# Altium schematic sheet max3107.SchDoc
size A4
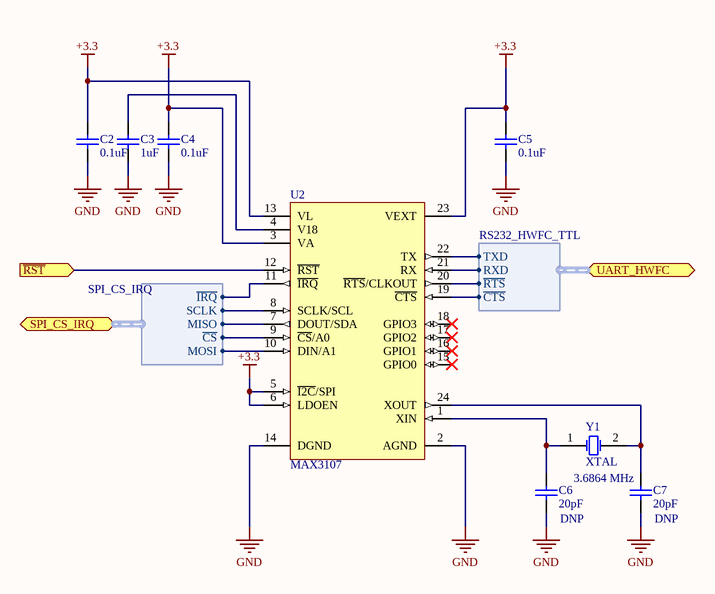
[diagram p0: max3107.SchDoc]

## Parts
C2  value 0.1uF  [C0603]  (hidden comment: Cap)
C3  value 1uF  [C0603]  (hidden comment: Cap)
C4  value 0.1uF  [C0603]  (hidden comment: Cap)
C5  value 0.1uF  [C0603]  (hidden comment: Cap)
C6  value 20pF  Place: DNP  [C0603]  (hidden comment: Cap)
C7  value 20pF  Place: DNP  [C0603]  (hidden comment: Cap)
U2  MAX3107  [MAX3107]
Y1  XTAL  value 3.6864 MHz  [FQ1045A-3.6864]

## Ports
SPI_CS_IRQ (harness SPI_CS_IRQ), UART_HWFC (harness RS232_HWFC_TTL), ~{RST} (in)

## Harnesses
SPI_CS_IRQ: ~{CS}, ~{IRQ}, MISO, MOSI, SCLK
RS232_HWFC_TTL: ~{CTS}, ~{RTS}, RXD, TXD

## Nets
+3.3: C2.1 C4.1 C5.1 U2.3(VA) U2.5(~{I2C}/SPI) U2.6(LDOEN) U2.13(VL) U2.23(VEXT)
GND: C2.2 C3.1 C4.2 C5.2 C6.2 C7.2 U2.2(AGND) U2.14(DGND)
~{RST}: U2.12(~{RST}) ; port ~{RST}
NetC3_2: C3.2 U2.4(V18)
NetC6_1: C6.1 U2.1(XIN) Y1.1(OSC1)
NetC7_1: C7.1 U2.24(XOUT) Y1.2(OSC2)
NetU2_7: U2.7(DOUT/SDA) ; port SPI_CS_IRQ.MISO
NetU2_8: U2.8(SCLK/SCL) ; port SPI_CS_IRQ.SCLK
NetU2_9: U2.9(~{CS}/A0) ; port SPI_CS_IRQ.~{CS}
NetU2_10: U2.10(DIN/A1) ; port SPI_CS_IRQ.MOSI
NetU2_11: U2.11(~{IRQ}) ; port SPI_CS_IRQ.~{IRQ}
NetU2_19: U2.19(~{CTS}) ; port UART_HWFC.~{CTS}
NetU2_20: U2.20(~{RTS}/CLKOUT) ; port UART_HWFC.~{RTS}
NetU2_21: U2.21(RX) ; port UART_HWFC.RXD
NetU2_22: U2.22(TX) ; port UART_HWFC.TXD

Not connected (* = marked no-connect by the designer): U2 15(GPIO0)* 16(GPIO1)* 17(GPIO2)* 18(GPIO3)*

## Library data of the parts
C2-C7 = Cap: Capacitor
  C2 C4 C5: farnell: 1759122
  C3: Published: 8-Jun-2000; LatestRevisionDate: 17-Jul-2002; LatestRevisionNote: Re-released for DXP Platform.; PackageReference: RAD-0.3; Publisher: Altium Limited; farnell: 1759399
U2 = MAX3107: Maxim Integrated MAX3107EAG+; mouser: 700-MAX3107EAG
Y1 = XTAL: Crystal Oscillator; Published: 8-Jun-2000; LatestRevisionDate: 17-Jul-2002; LatestRevisionNote: Re-released for DXP Platform.; PackageReference: R38; Publisher: Altium Limited; farnell: 1641055